# EAGLE schematic Multipad (EAGLE 9.5.0)
as
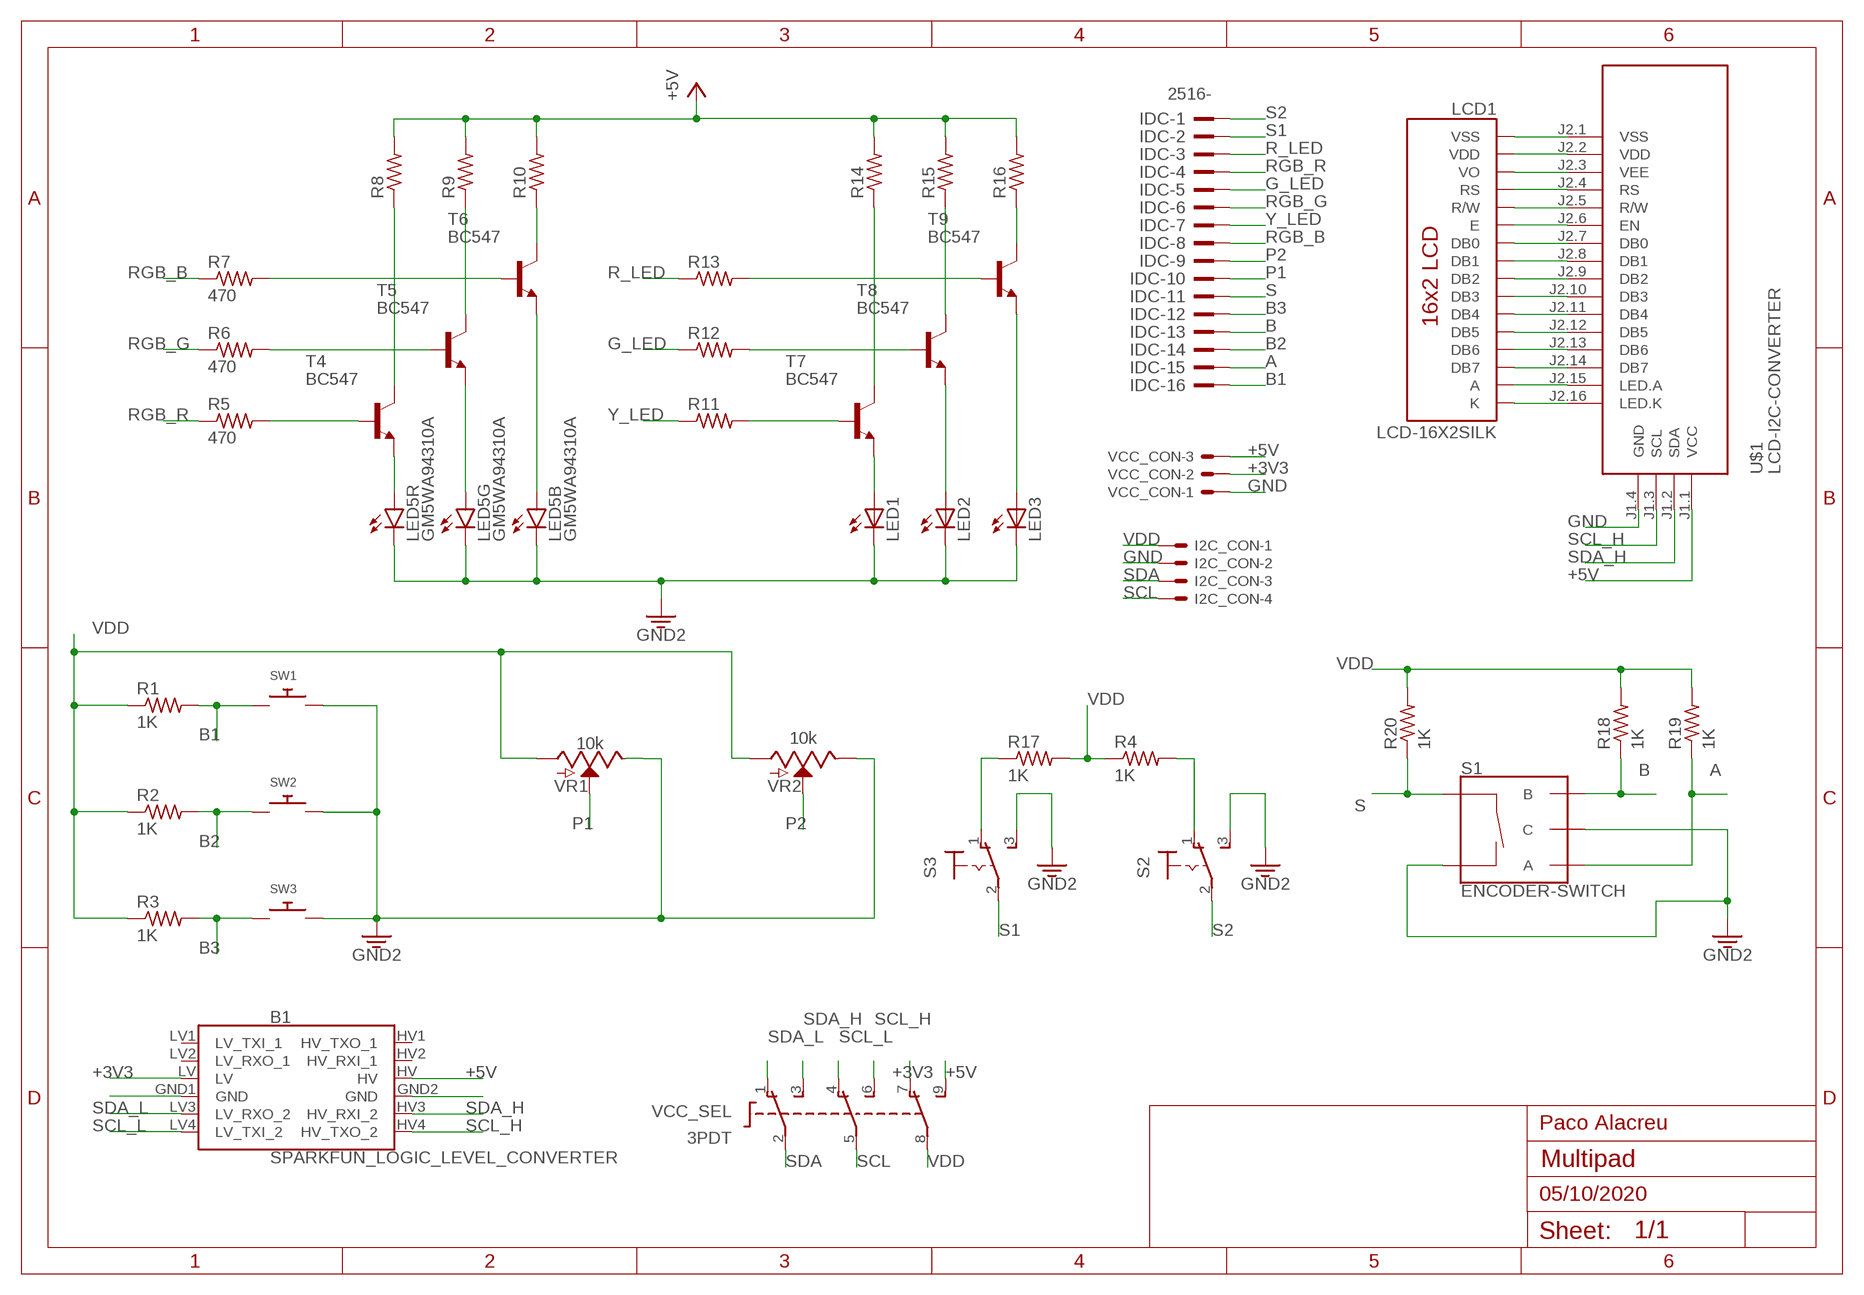
[diagram p0: schematic, sheet 1]

## Parts
B1  SPARKFUN_LOGIC_LEVEL_CONVERTER  [SPARKFUN_LOGIC_LEVEL_CONVERTER]
I2C_CON  KK-156-4  [KK-156-4]
IDC  2516-  [PAK100/2500-16]
LCD1  LCD-16X2SILK  [LCD-16X2]
LED1  LED5MM  [LED5MM]
LED2  LED5MM  [LED5MM]
LED3  LED5MM  [LED5MM]
LED5  GM5WA94310A  [GM5WA94310A]
R1  1K  R-US_0207/12  [0207/12]
R2  1K  R-US_0207/12  [0207/12]
R3  1K  R-US_0207/12  [0207/12]
R4  1K  R-US_0207/12  [0207/12]
R5  470  R-US_0207/12  [0207/12]
R6  470  R-US_0207/12  [0207/12]
R7  470  R-US_0207/12  [0207/12]
R8  R-US_0207/12  [0207/12]
R9  R-US_0207/12  [0207/12]
R10  R-US_0207/12  [0207/12]
R11  R-US_0207/12  [0207/12]
R12  R-US_0207/12  [0207/12]
R13  R-US_0207/12  [0207/12]
R14  R-US_0207/12  [0207/12]
R15  R-US_0207/12  [0207/12]
R16  R-US_0207/12  [0207/12]
R17  1K  R-US_0207/12  [0207/12]
R18  1K  R-US_0207/12  [0207/12]
R19  1K  R-US_0207/12  [0207/12]
R20  1K  R-US_0207/12  [0207/12]
S1  ENCODER-SWITCH  [ROTARY_ENC_PLAIN]
S2  320-916  [320-916]
S3  320-916  [320-916]
SW1  SWITCH_PUSHBUTTONSOFTTOUCHSMD_SJ  [PUSHBUTTON_SMD_SJ]
SW2  SWITCH_PUSHBUTTONSOFTTOUCHSMD_SJ  [PUSHBUTTON_SMD_SJ]
SW3  SWITCH_PUSHBUTTONSOFTTOUCHSMD_SJ  [PUSHBUTTON_SMD_SJ]
T4  BC547  [TO92]
T5  BC547  [TO92]
T6  BC547  [TO92]
T7  BC547  [TO92]
T8  BC547  [TO92]
T9  BC547  [TO92]
U$1  LCD-I2C-CONVERTER  [LCD-I2C-CONVERTER]
VCC_CON  KK-156-3  [KK-156-3]
VCC_SEL  3PDT  [3PDT]
VR1  10k  POTENTIOMETER-PTH-9MM-1/20W-20%-KIT  [POT-PTH-ALPS-KIT]
VR2  10k  POTENTIOMETER-PTH-9MM-1/20W-20%-KIT  [POT-PTH-ALPS-KIT]

## Nets
+3V3: B1.LV VCC_CON.2 VCC_SEL.7(O3)
+5V: B1.HV R8.2 R9.2 R10.2 R14.2 R15.2 R16.2 U$1.J1.1(VCC) VCC_CON.3 VCC_SEL.9(S3)
A: IDC.15 R19.1 S1.A
B: IDC.13 R18.1 S1.B
B1: IDC.16 R1.2 SW1.P$1
B2: IDC.14 R2.2 SW2.P$1
B3: IDC.12 R3.2 SW3.P$1
G_LED: IDC.5 R12.1
GND: B1.GND1(GND) B1.GND2(GND) I2C_CON.2 LED1.K(C) LED2.K(C) LED3.K(C) LED5.4(G:C) LED5.5(R:C) LED5.6(B:C) S1.C S1.SW- S2.3(S) S3.3(S) SW1.P$2 SW2.P$2 SW3.P$2 U$1.J1.4(GND) VCC_CON.1 VR1.P$1(E) VR2.P$1(E) ; supply symbol labelled GND2
N$1: LED5.2(R:A) T4.1(E)
N$2: LED5.3(G:A) T5.1(E)
N$3: LED5.1(B:A) T6.1(E)
N$4: R5.2 T4.2(B)
N$5: R6.2 T5.2(B)
N$6: R7.2 T6.2(B)
N$7: R8.1 T4.3(C)
N$8: R9.1 T5.3(C)
N$9: R10.1 T6.3(C)
N$10: LED1.A T7.1(E)
N$11: LED2.A T8.1(E)
N$12: R11.2 T7.2(B)
N$13: R12.2 T8.2(B)
N$14: R13.2 T9.2(B)
N$15: R14.1 T7.3(C)
N$16: R15.1 T8.3(C)
N$17: R16.1 T9.3(C)
N$18: LED3.A T9.1(E)
N$20: LCD1.1(VSS) U$1.J2.1(VSS)
N$21: LCD1.2(VDD) U$1.J2.2(VDD)
N$22: LCD1.3(VO) U$1.J2.3(VEE)
N$23: LCD1.5(R/W) U$1.J2.5(R/W)
N$24: LCD1.6(E) U$1.J2.6(EN)
N$25: LCD1.7(DB0) U$1.J2.7(DB0)
N$26: LCD1.8(DB1) U$1.J2.8(DB1)
N$27: LCD1.9(DB2) U$1.J2.9(DB2)
N$28: LCD1.10(DB3) U$1.J2.10(DB3)
N$29: LCD1.11(DB4) U$1.J2.11(DB4)
N$30: LCD1.12(DB5) U$1.J2.12(DB5)
N$31: LCD1.13(DB6) U$1.J2.13(DB6)
N$32: LCD1.14(DB7) U$1.J2.14(DB7)
N$33: LCD1.15(A) U$1.J2.15(LED.A)
N$34: LCD1.16(K) U$1.J2.16(LED.K)
N$35: R4.2 S2.1(O)
N$36: R17.1 S3.1(O)
P1: IDC.10 VR1.P$2(S)
P2: IDC.9 VR2.P$2(S)
R_LED: IDC.3 R13.1
RGB_B: IDC.8 R7.1
RGB_G: IDC.6 R6.1
RGB_R: IDC.4 R5.1
S: IDC.11 R20.1 S1.SW+
S1: IDC.2 S3.2(P)
S2: IDC.1 S2.2(P)
SCL: I2C_CON.4 VCC_SEL.5(P2)
SCL_H: B1.HV4(HV_TXO_2) U$1.J1.3(SCL) VCC_SEL.6(S2)
SCL_L: B1.LV4(LV_TXI_2) LCD1.4(RS) U$1.J2.4(RS) VCC_SEL.4(O2)
SDA: I2C_CON.3 VCC_SEL.2(P1)
SDA_H: B1.HV3(HV_RXI_2) U$1.J1.2(SDA) VCC_SEL.3(S1)
SDA_L: B1.LV3(LV_RXO_2) VCC_SEL.1(O1)
VDD: I2C_CON.1 R1.1 R2.1 R3.1 R4.1 R17.2 R18.2 R19.2 R20.2 VCC_SEL.8(P3) VR1.P$3(A) VR2.P$3(A)
Y_LED: IDC.7 R11.1
Unconnected: B1.HV1(HV_TXO_1) B1.HV2(HV_RXI_1) B1.LV1(LV_TXI_1) B1.LV2(LV_RXO_1)

## Notes on the sheet
- Paco Alacreu
- 05/10/2020

## Library data of the parts
B1 = SparkFun-Boards:SPARKFUN_LOGIC_LEVEL_CONVERTER: SparkFun Logic Level Converter -Bi-Directional This is the mechnical outline for the 3.3V - 5V bi directional logic level converter. *Note, the "LOCK" Package has the header pins staggered by an offset of 5 mils (off center line), so that when you slide a row of standard 0.1" headers into the PTH pads, it will hold position vertically. See the follwing turorial for more information on this type of special footprints: Sneaky Footprints <https://www.sparkfun.com/tutorials/114> SparkFun Products: SparkFun Logic Level Converter - Bi-Directional <https://www.sparkfun.com/products/12009>
I2C_CON = con-molex:KK-156-4: KK 156 HEADER Source: http://www.molex.com/pdm_docs/sd/026604100_sd.pdf; MF: MOLEX; OC_FARNELL: unknown; OC_NEWARK: unknown
IDC = con-3m:2516-: 3M (TM) Pak 100 4-Wall Header Source: 3M; OC_FARNELL: unknown; OC_NEWARK: unknown
LCD1 = SparkFun-Displays:LCD-16X2: Standard text-only 16x2 parallel input LCD Basic 16 character by 2 line display. Typically utilizes the extremely common HD44780 parallel interface chipset SparkFun Products: Basic 16x2 Green <https://www.sparkfun.com/products/255> Basic 8x2 Green <https://www.sparkfun.com/products/11122>; SF_ID: LCD-00255
LED1-LED3 = adafruit:LED: LED OSRAM: - CHIPLED LG R971, LG N971, LY N971, LG Q971, LY Q971, LO R971, LY R971 LH N974, LH R974 LS Q976, LO Q976, LY Q976 LO Q996 - Hyper CHIPLED LW Q18S LB Q993, LB Q99A, LB R99A - SideLED LS A670, LO A670, LY A670, LG A670, LP A670 LB A673, LV A673, LT A673, LW A673 LH A674 LY A675 LS A676, LA A676, LO A676, LY A676, LW A676 LS A679, LY A679, LG A679 - Hyper Micro SIDELED® LS Y876, LA Y876, LO Y876, LY Y876 LT Y87S - SmartLED LW L88C, LW L88S LB L89C, LB L89S, LG L890 LS L89K, LO L89K, LY L89K LS L896, LA L896, LO L896, LY L896 - TOPLED LS T670, LO T670, LY T670, LG T670, LP T670 LSG T670, LSP T670, LSY T670, LOP T670, LYG T670 LG T671, LOG T671, LSG T671 LB T673, LV T673, LT T673, LW T673 LH T674 LS T676, LA T676, LO T676, LY T676, LB T676, LH T676, LSB T676, LW T676 LB T67C, LV T67C, LT T67C, LS T67K, LO T67K, LY T67K, LW E67C LS E67B, LA E67B, LO E67B, LY E67B, LB E67C, LV E67C, LT E67C LW T67C LS T679, LY T679, LG T679 LS T770, LO T770, LY T770, LG T770, LP T770 LB T773, LV T773, LT T773, LW T773 LH T774 LS E675, LA E675, LY E675, LS T675 LS T776, LA T776, LO T776, LY T776, LB T776 LHGB T686 LT T68C, LB T68C - Hyper Mini TOPLED® LB M676 - Mini TOPLED Santana® LG M470 LS M47K, LO M47K, LY M47K Source: http://www.osram.convergy.de/
LED5 = led:GM5WA94310A: Chip LED RGB Source: http://document.sharpsma.com/files/GM5WA94310A_SS.pdf
R1-R20 = BeagleBone_Black_Wireless:R-US_: RESISTOR, American symbol
S1 = SparkFun-Switches:ENCODER-SWITCH: Rotary Encoder w/ Select Switch Encoders rotate similarly to potentiometers, but they’re different from potentiometers in that an encoder has full rotation without limits. They output gray code so that you can tell how much and in which direction the encoder has been turned. This encoder includes a push-down select switch built into the shaft. SparkFun Products Rotary Encoder <https://www.sparkfun.com/products/9117> (COM-09117); SF_SKU: COM-09117
S2 S3 = switch:320-916: TOGGLE SWITCH distributor RS Components
SW1-SW3 = adafruit:SWITCH_PUSHBUTTON: Buttons SOFTTOUCHSMD_SJ - Soft touch temporary push button (Super Junk Akihabara) Compatible with SKPMANE010 [Mouser: 688-SKPMAN] C&K_KSS = Digikey: KSS221GLFS
T4-T9 = transistor:BC547: NPN TRANSISTOR
U$1 = diy-modules:LCD-I2C-CONVERTER: I2C Bus to 4-Bit Parallel LCD Interface with LED backlight driver
VCC_CON = con-molex:KK-156-3: KK 156 HEADER Source: http://www.molex.com/pdm_docs/sd/026604100_sd.pdf; MF: MOLEX; OC_FARNELL: unknown; OC_NEWARK: unknown
VCC_SEL = switch:3PDT: 3PDT 9 pin footswitch SF17020F-0302-21R-L Source: 3PDT.jpg
VR1 VR2 = SparkFun-Resistors:POTENTIOMETER: Potentiometer (Pot) Three-terminal potentiometers, with an adjustable wiper and two adjustable resistors. A pot can be used to create a configurable voltage divider, or as a variable resistor. Variants ALPS_POT and ALPS_POT_KIT - PTH, breadboard compatible, 9mm square pots Rotary Potentiometer - Linear (10k ohm) <https://www.sparkfun.com/products/9288> (COM-09288) The KIT variant exposes copper on only one side of the PTH pad, so the part can only be assembled on one side of the PCB. Useful for beginner soldering kits.; PROD_ID: RES-09177; SF_SKU: COM-09288